# EasyEDA schematic ServoDriverV2.json
TITLE: Sheet_1; REV: 1.0; Date: 2023-09-14; Sheet: 1/1; Drawn By: townlake101; Company: Your Company
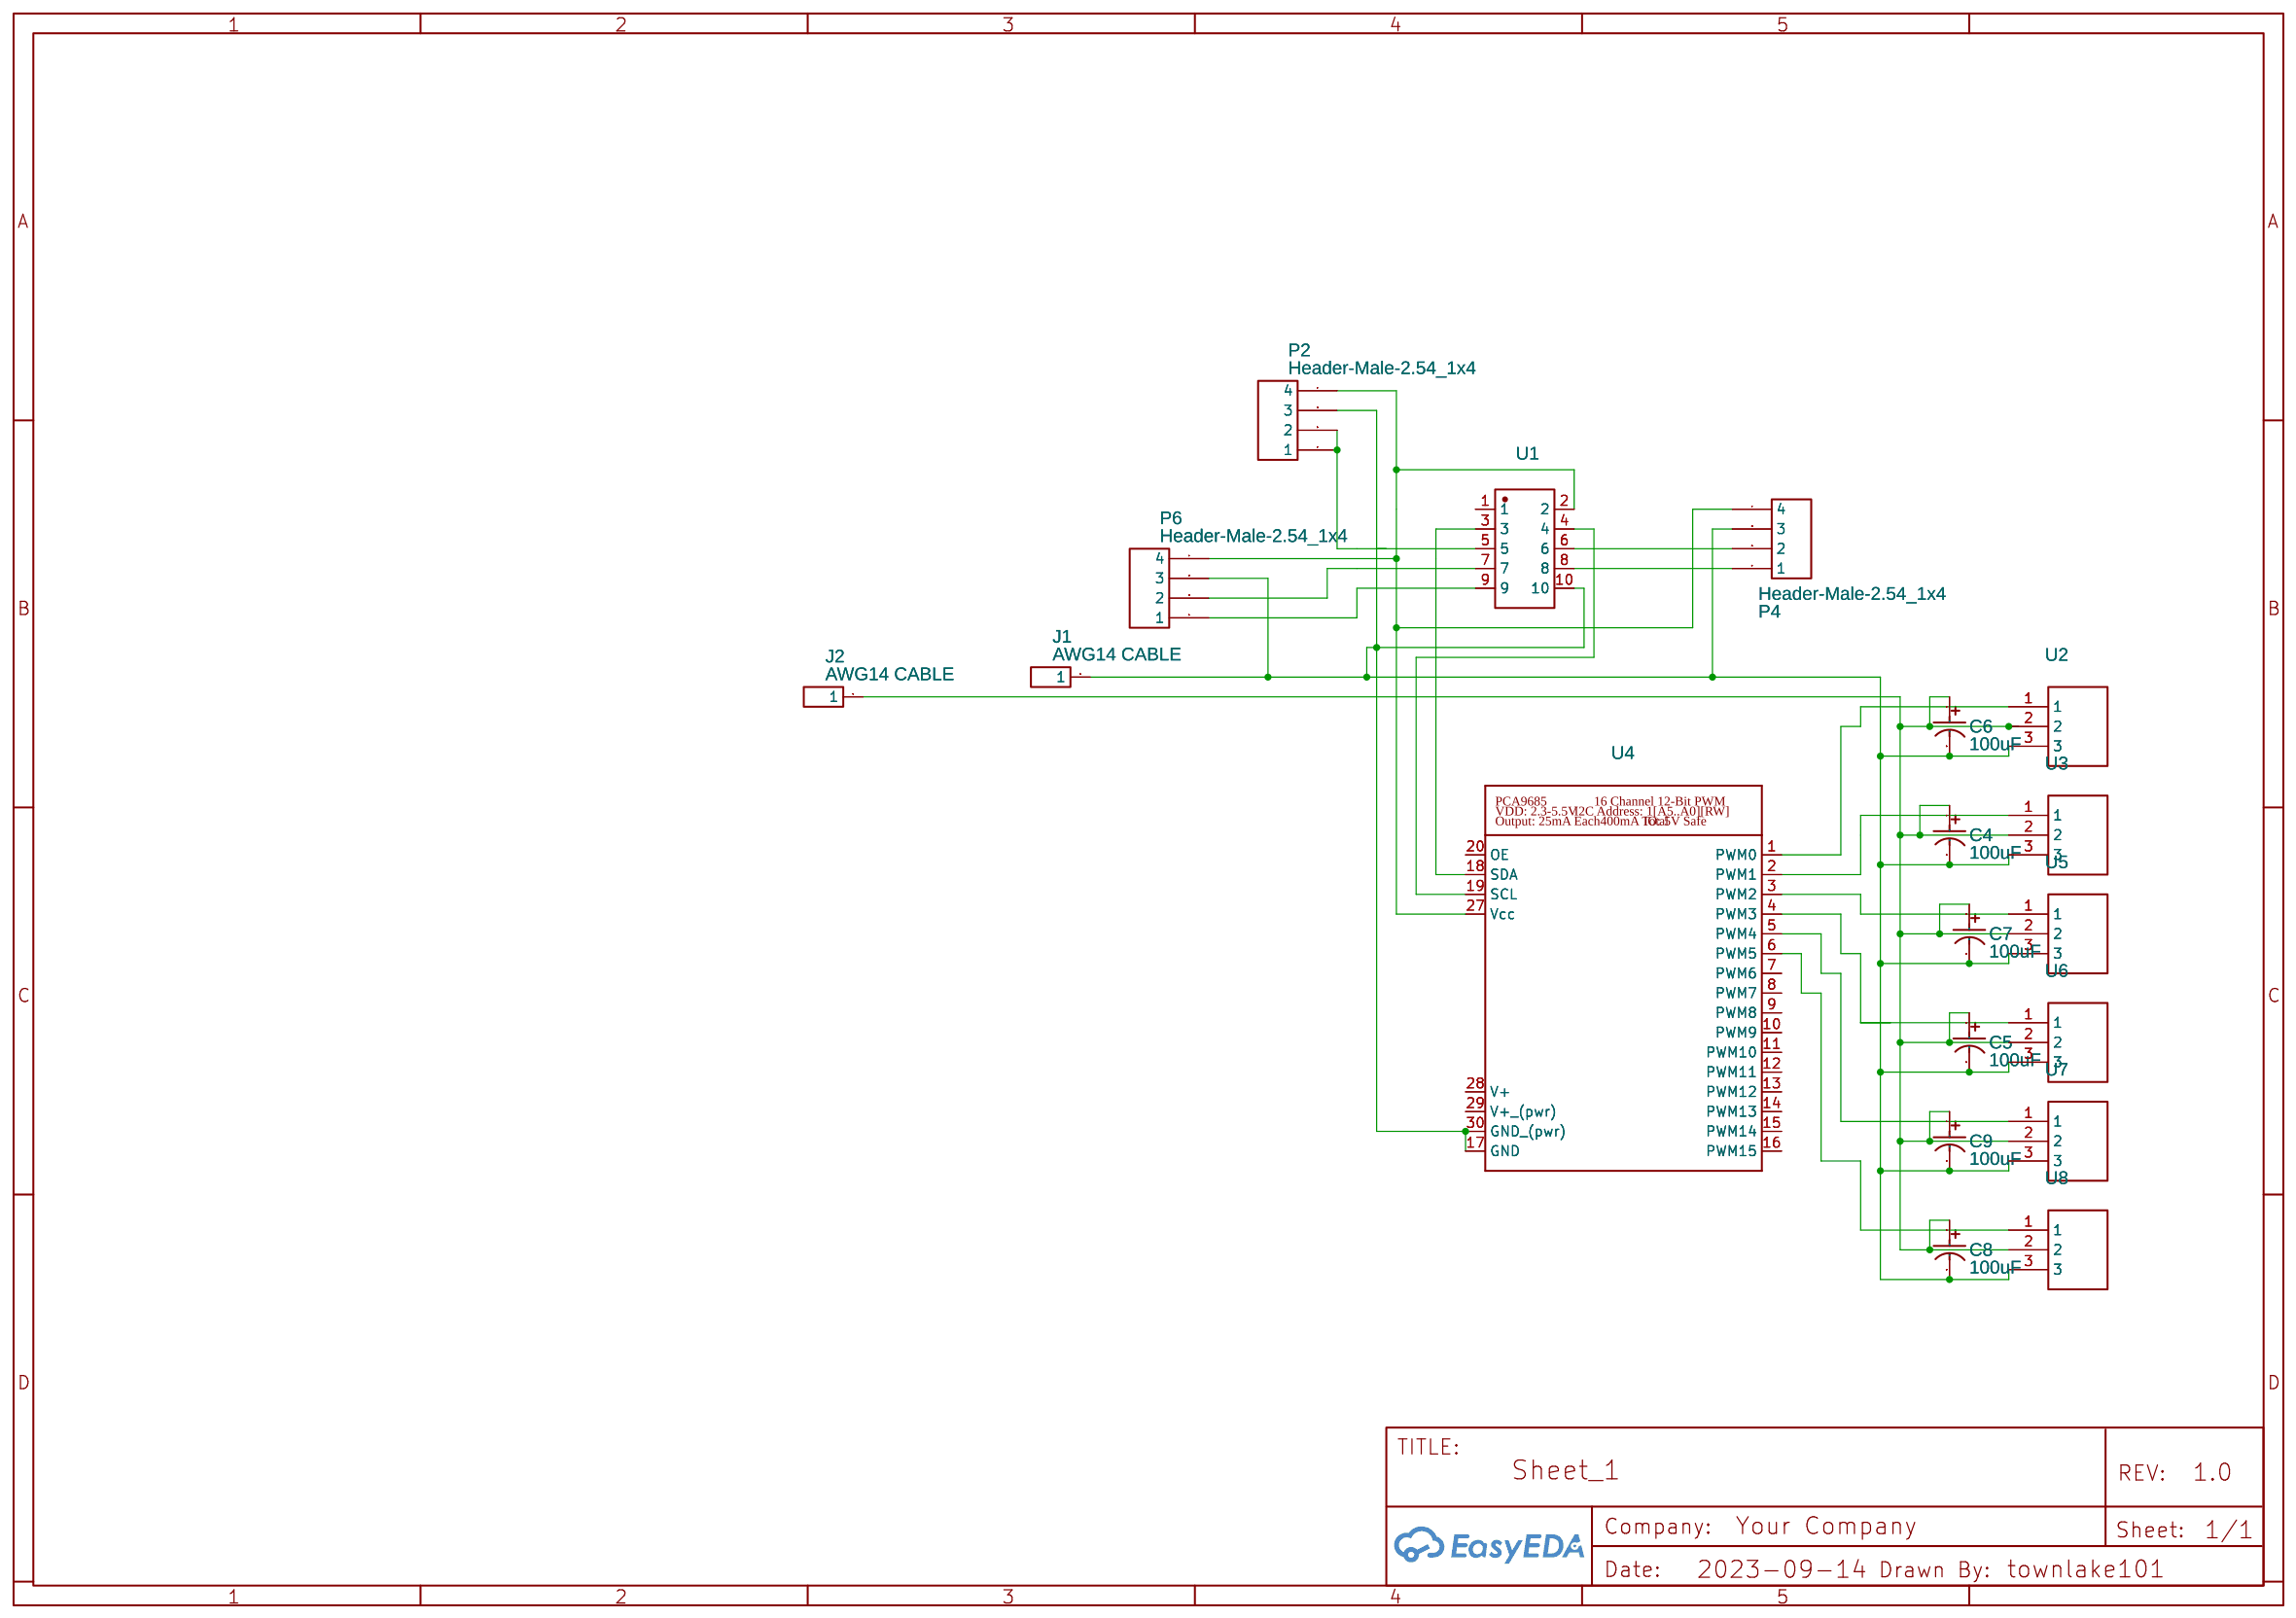
[diagram p0: schematic sheet]

## Parts
C4  100uF  [100UFX16V CAPACITOR D5.0XF11.0]
C5  100uF  [100UFX16V CAPACITOR D5.0XF11.0]
C6  100uF  [100UFX16V CAPACITOR D5.0XF11.0]
C7  100uF  [100UFX16V CAPACITOR D5.0XF11.0]
C8  100uF  [100UFX16V CAPACITOR D5.0XF11.0]
C9  100uF  [100UFX16V CAPACITOR D5.0XF11.0]
J1  AWG14 CABLE  [AWG14-HOLE]
J2  AWG14 CABLE  [AWG14-HOLE]
P2  Header-Male-2.54_1x4  [HDR-4X1/2.54]
P4  Header-Male-2.54_1x4  [HDR-4X1/2.54]
P6  Header-Male-2.54_1x4  [HDR-4X1/2.54]
U1  NO  [CONN-TH_10P-P2.54_KINGHELM_KH-2.54PH180-2X5P-L8.9]
U2  NO  [HDR-3X1/2.54]
U3  NO  [HDR-3X1/2.54]
U4  NO  [PCA9685]
U5  NO  [HDR-3X1/2.54]
U6  NO  [HDR-3X1/2.54]
U7  NO  [HDR-3X1/2.54]
U8  NO  [HDR-3X1/2.54]

## Library data of the parts
C4-C9 = CAP-POL-1: Supplier: My_collection; Manufacturer Part: Jweo; Rated Voltage: 16V; Contributor: stefanczykdk
J1 J2 = AWG14 CABLE: Manufacturer: PCB; Manufacturer Part: AWG14 HOLE; Supplier Part: PCB; Contributor: Joseph Pramudito
P2 P4 P6 = Header-Male-2.54_1x4: Supplier: LCSC; Manufacturer: ReliaPro; Manufacturer Part: Headers  Pins 1*4P; image: http://image.lceda.cn/szlcsc/C59481.jpg; Supplier Part: C59481; Contributor: NC North
U1 = KH-2.54PH180-2X5P: Supplier: LCSC; Supplier Part: C5157628; Manufacturer: kinghelm(金航标); Manufacturer Part: KH-2.54PH180-2X5P-L8.9; link: https://atta.szlcsc.com/upload/public/pdf/source/20220906/04BEB622ED10B556BB25C8F90E10FD05.pdf; Contributor: lcsc; JLCPCB Part Class: Extended Part
U2 U3 U5-U8 = conector-3-PINOS: Contributor: claudiomcs; A: B
U4 = PCA9685_module_mod: Contributor: Quentin Chatenet

## Nets
Net-(C4-1): C4.1 C5.1 C6.1 C7.1 C8.1 C9.1 J2.1 U2.2 U3.2 U5.2 U6.2 U7.2 U8.2
Net-(C4-2): C4.2 C5.2 C6.2 C7.2 C8.2 C9.2 J1.1 P2.3 P4.3 P6.3 U1.10 U2.3 U3.3 U4.17(GND) U4.30(GND (pwr)) U5.3 U6.3 U7.3 U8.3
Net-(P2-1): P2.1 P2.2 U1.5
Net-(P2-4): P2.4 P4.4 P6.4 U1.2 U4.27(Vcc)
Net-(P4-1): P4.1 U1.8
Net-(P4-2): P4.2 U1.6
Net-(P6-1): P6.1 U1.9
Net-(P6-2): P6.2 U1.7
Net-(U1-3): U1.3 U4.18(SDA)
Net-(U1-4): U1.4 U4.19(SCL)
Net-(U2-1): U2.1 U4.1(PWM0)
Net-(U3-1): U3.1 U4.2(PWM1)
Net-(U4-3): U4.3(PWM2) U5.1
Net-(U4-4): U4.4(PWM3) U6.1
Net-(U4-5): U4.5(PWM4) U7.1
Net-(U4-6): U4.6(PWM5) U8.1

Not connected (* = marked no-connect by the designer): U1 1; U4 7(PWM6) 8(PWM7) 9(PWM8) 10(PWM9) 11(PWM10) 12(PWM11) 13(PWM12) 14(PWM13) 15(PWM14) 16(PWM15) 20(OE) 28(V+) 29(V+ (pwr))
